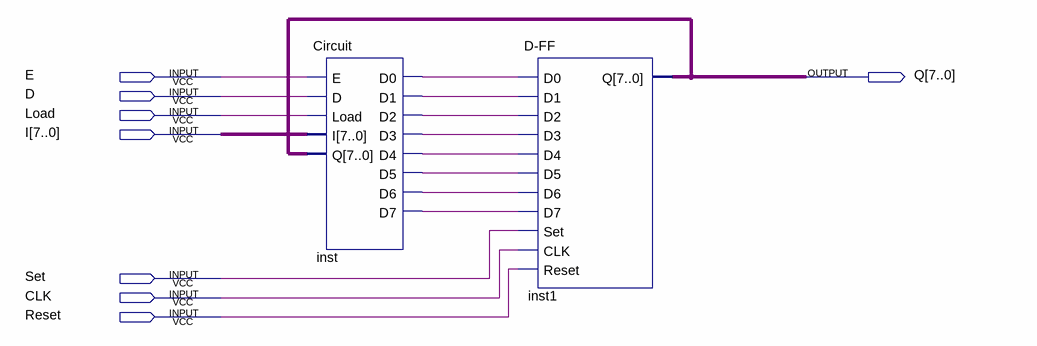
[diagram p0: schematic sheet]
// Quartus schematic Counter8bit.bdf as structural Verilog: 2 symbols, 8 pins
module Counter8bit (
  input  E,
  input  D,
  input  Load,
  input  [7:0] I,
  input  Set,
  input  CLK,
  input  Reset,
  output [7:0] Q
);

  wire inst_d0, inst_d1, inst_d2, inst_d3, inst_d4, inst_d5, inst_d6, inst_d7;

  Circuit inst (
    .E(E), .D(D), .Load(Load), .I(I), .Q(Q), .D0(inst_d0), .D1(inst_d1), .D2(inst_d2), .D3(inst_d3),
    .D4(inst_d4), .D5(inst_d5), .D6(inst_d6), .D7(inst_d7));
  \D-FF  inst1 (
    .D0(inst_d0), .D1(inst_d1), .D2(inst_d2), .D3(inst_d3), .D4(inst_d4), .D5(inst_d5), .D6(inst_d6),
    .D7(inst_d7), .Set(Set), .CLK(CLK), .Reset(Reset), .Q(Q));
endmodule
